# EAGLE board BT60 (EAGLE 9.6.2)
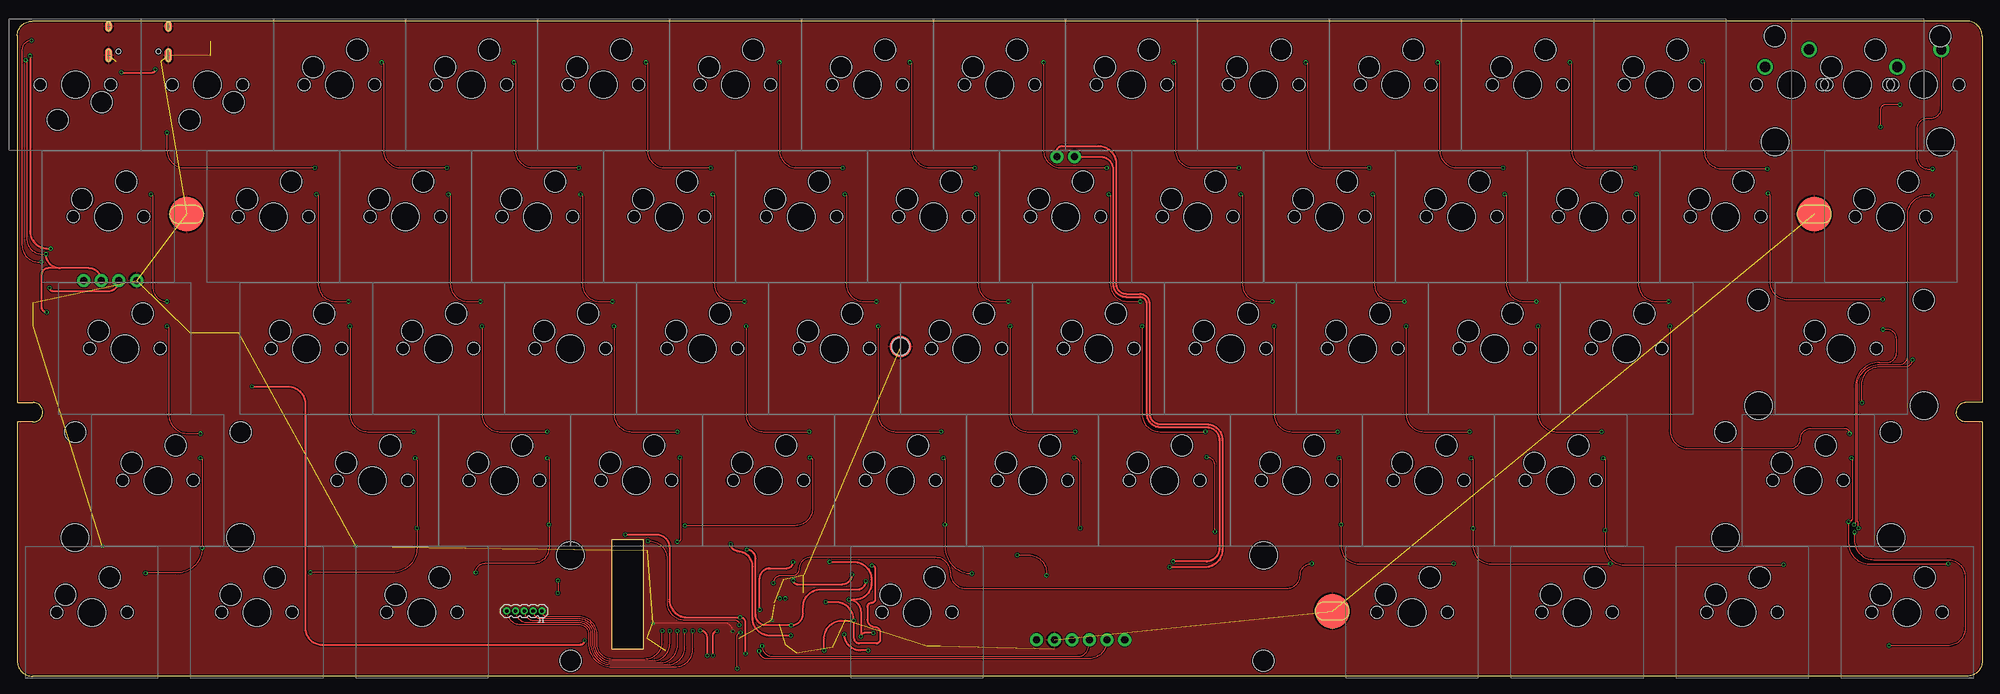
[diagram p2: board, top side]
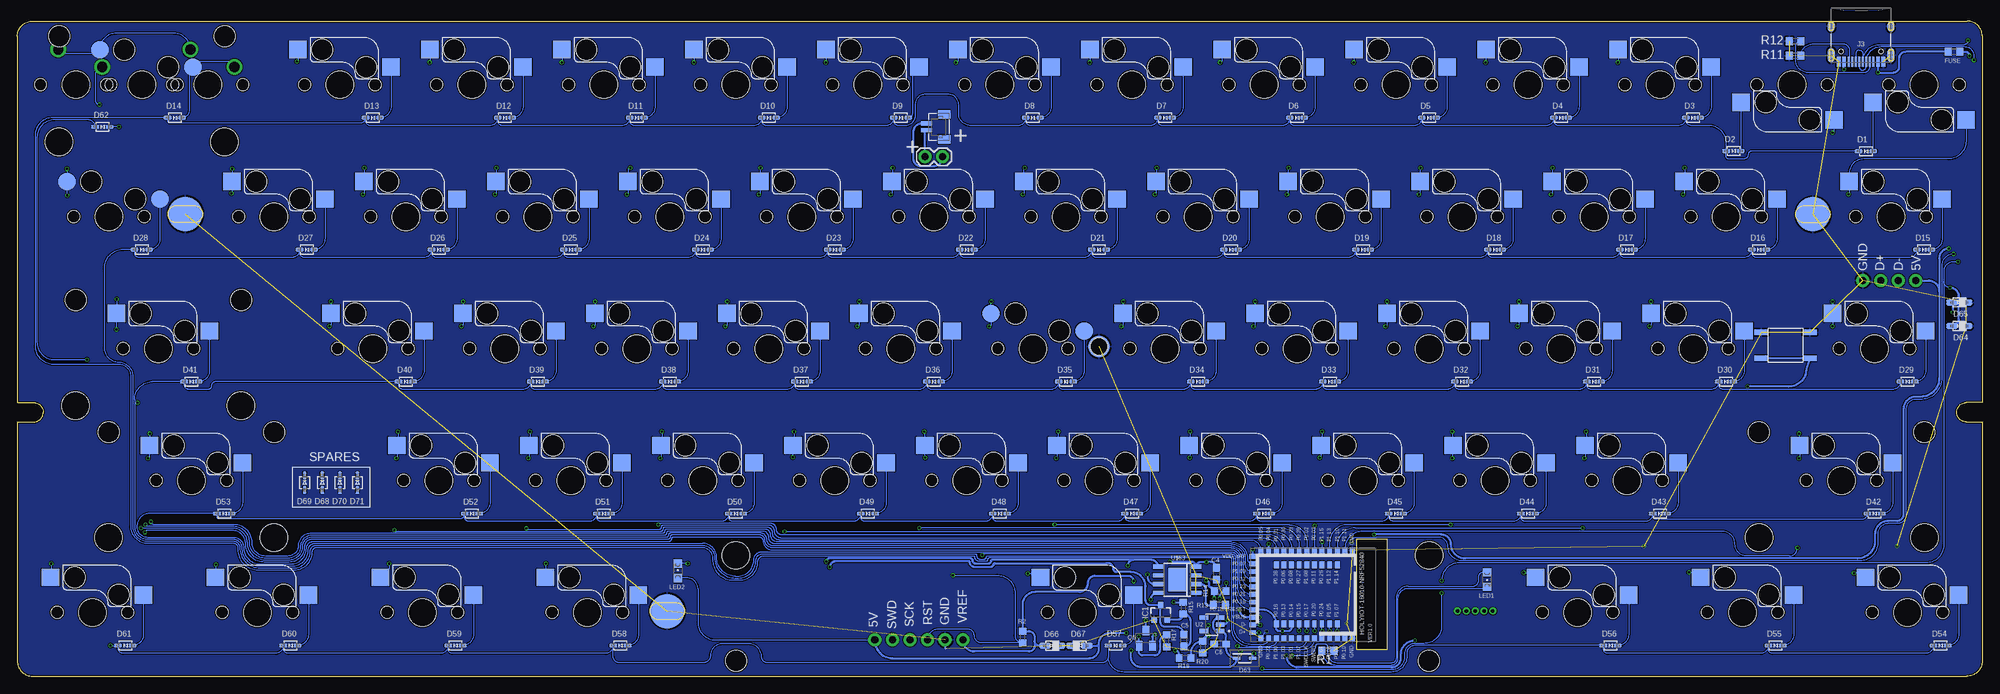
[diagram p3: board, bottom side, seen from below]

Size 283.53 x 94.59 mm. Coordinates in mm from the lower left corner, seen from the top.
Outline: 281.32,94.59 2.15,94.59 arc90 0.01,92.46 0,92.44 0,39.5 2.29,39.5 arc-90 3.68,38.1 arc-90 2.29,36.7 0,36.7 0,2.21 arc90 2.21,0 281.32,0 arc90 283.53,2.21 283.53,36.7 281.18,36.7 arc-90 279.78,38.1 arc-90 281.18,39.5 283.53,39.5 283.53,92.38 arc90 281.32,94.59
Copper layers (1*16): Top 0.035559375mm / dielectric 1.6mm / Bottom 0.035559375mm
Design rules "jlcpcb2layer": minimum track width 5mil, minimum drill 12mil, track to track 5mil, track to pad 5mil, pad to pad 5mil, via to via 5mil, smd to smd 5mil, copper to edge 8mil, drill to drill 6mil, minimum pad ring 5mil, minimum via ring 3mil, stop-mask expansion 2.5mil, vias tented up to drill 0mil, thermal gap 10mil

## Footprints (pad centres in the part's own frame; a part is rotated, then mirrored left to right if it is on the bottom)
C0603 = smd 1.1 x 1: 1 -0.85,0; 2 0.85,0
BM02B-SRSS-TB = smd 0.6 x 1.55: 1 0.5,0; 2 -0.5,0 | smd 1.2 x 1.8: M1 1.8,-2.525; M2 -1.8,-2.525
SOD-323 = smd 1.14 x 0.52: A 1.04,0; C -1.04,0
SOD2713X115N = smd 1.125 x 0.5: 1 -1.162,0; 2 1.162,0
SOD-323' = smd 1.676 x 0.813: A 1.04,0; C -1.04,0
R0603 = smd 1 x 1.1: 1 -0.85,0; 2 0.85,0
SOT23-3 = smd 0.8 x 0.9: 1 -0.95,-1; 2 0.95,-1; 3 0,1.1
PCBCOMPONENT_1 = smd 0.7 x 0.9: D+ 5.5,-7.8; D- 4.4,-7.8; P0.07 -4.4,-7.8; P0.12 -2.2,-7.8; P0.18 2.2,-7.8; P0.19 1.1,-7.8; P0.21 0,-7.8; P0.23 -1.1,-7.8; P1.09 -3.3,-7.8; VBUS 3.3,-7.8; VDD_NRF -5.5,-7.8 | smd 0.9 x 0.7: GND -6.35,6.6; GND1 6.35,-6.6; GND2 6.35,6.6; P0.02 -6.35,0; P0.03 -6.35,1.1; P0.04 -6.35,-5.5; P0.05 -6.35,-6.6; P0.09 6.35,4.4; P0.10 6.35,5.5; P0.22 6.35,-5.5; P0.28 -6.35,-1.1; P0.29 -6.35,-2.2; P0.30 -6.35,-3.3; P0.31 -6.35,-4.4; P1.00 6.35,-4.4; P1.01 6.35,-2.2; P1.02 6.35,-1.1; P1.03 6.35,-3.3; P1.04 6.35,2.2; P1.06 6.35,3.3; P1.10 -6.35,4.4; P1.11 -6.35,5.5; P1.13 -6.35,3.3; P1.15 -6.35,2.2; SWDCLK 6.35,0; SWDIO 6.35,1.1 | smd 1 x 0.7: P0.06 -4.25,-3.3; P0.08 -4.25,-2.2; P0.11 -4.25,1.1; P0.13 4.25,-3.3; P0.14 4.25,-2.2; P0.15 4.25,-1.1; P0.16 4.25,-4.4; P0.17 4.25,0; P0.25 -4.25,2.2; P0.26 -4.25,-4.4; P0.27 -4.25,-1.1; P1.05 4.25,3.3; P1.07 4.25,4.4; P1.08 -4.25,0; P1.12 -4.25,3.3; P1.14 -4.25,4.4 | smd 1 x 0.6: P0.20 4.25,1.1; P0.24 4.25,2.2
1X05_1.27MM = drill 0.508 pad 1: 1 0,0; 2 1.27,0; 3 2.54,0; 4 3.81,0; 5 5.08,0
1X04_NO_SILK = drill 1.016 pad 1.88: 1 0,0; 2 2.54,0; 3 5.08,0; 4 7.62,0
SPARKFUN-CONNECTORS_USB-C-16P = smd 0.3 x 1.45: A5 -1.25,0; A6 -0.25,0; A7 0.25,0; A8 1.25,0; B5 1.75,0; B6 0.75,0; B7 -0.75,0; B8 -1.75,0 | smd 0.6 x 1.45: GND -3.225,0; GND2 3.225,0 | smd 1 x 2.1: SHLD1 -4.32,-0.915; SHLD2 4.32,-0.915 | smd 1 x 2.1 bottom: SHLD3 -4.32,-0.915; SHLD4 4.32,-0.915 | smd 1 x 1.6: SHLD5 -4.32,-5.095; SHLD8 4.32,-5.095 | smd 1 x 1.6 bottom: SHLD6 -4.32,-5.095; SHLD7 4.32,-5.095 | smd 0.55 x 1.45: VBUS1 -2.45,0; VBUS2 2.45,0 | hole 0.65: -2.89,-1.445; 2.89,-1.445
1X02 = drill 1.016 pad 1.88: 1 0,0; 2 2.54,0
CHIPLED_0805 = smd 1.2 x 1.2: A 0,-1.05; C 0,1.05
1X06_NO_SILK = drill 1.016 pad 1.88: 1 0,0; 2 2.54,0; 3 5.08,0; 4 7.62,0; 5 10.16,0; 6 12.7,0
SOT23 = smd 1 x 1.4: 1 -0.95,-1.1; 2 0.95,-1.1; 3 0,1.1
SOT95P285X140-5N = smd 1.35 x 0.6: 1 -1.185,0.95; 2 -1.185,0; 3 -1.185,-0.95; 4 1.185,-0.95; 5 1.185,0.95
CHERRY = smd 2.55 x 2.5 bottom: 1 -7.37,2.54; 2 6.05,5.08 | hole 3.988: 0,0 | hole 1.753: 5.08,0; -5.08,0 | hole 3.048: -3.81,2.54; 2.54,5.08
CHERRY_CORNER_OFFED = smd 2.55 x 2.5 bottom: 1 -7.37,2.54; 2 6.05,5.08 | hole 3.988: 0,0 | hole 1.753: 5.08,0; -5.08,0 | hole 3.048: -3.81,2.54; 2.54,5.08
SMD-BUTTON = smd 2 x 0.75: A -3.5,1.875; B 3.5,1.875; C -3.5,-1.875; D 3.5,-1.875
SOIC8 = smd 0.6 x 1.5: 1 -1.905,-2.75; 2 -0.635,-2.75; 3 0.635,-2.75; 4 1.905,-2.75; 5 1.905,2.75; 6 0.635,2.75; 7 -0.635,2.75; 8 -1.905,2.75 | smd 3.4 x 2.5: P$1 0,0
2.5MM_ELONGATED = smd 5 x 5: P$1 0,0 | smd 5 x 5 bottom: P$2 0,0
2.5MM_HOLE = smd 3.1 x 3.1 bottom: P$1 0,0 | smd 3.1 x 3.1: P$2 0,0 | hole 2.5: 0,0
STAB-2U = hole 3.988: -11.938,-8.255; 11.938,-8.255 | hole 3.048: -11.938,6.985; 11.938,6.985
STAB-6.25U = hole 3.988: -50,-8.255; 50,-8.255 | hole 3.048: -50,6.985; 50,6.985
CHERRY-SOLDER = drill 1.499: P$1 -3.81,2.54; P$2 2.54,5.08 | hole 3.988: 0,0 | hole 1.702: -5.08,0; 5.08,0

## Placement (x,y rotation side)
C4  10u  [C0603]  110.49,14.8 270 bottom
C5  100n  [C0603]  115.2,5.16 90 bottom
C6  4.7u  [C0603]  109.96,4.64 180 bottom
CN2  BM02B-SRSS-TB  [BM02B-SRSS-TB]  152.32,79.31 90 bottom
D1  1N4148WS  [SOD-323]  16.78,75.79 0 bottom
D2  1N4148WS  [SOD-323]  35.88,75.82 0 bottom
D3  1N4148WS  [SOD-323]  41.72,80.63 0 bottom
D4  1N4148WS  [SOD-323]  60.77,80.63 0 bottom
D5  1N4148WS  [SOD-323]  79.82,80.63 0 bottom
D6  1N4148WS  [SOD-323]  98.87,80.63 0 bottom
D7  1N4148WS  [SOD-323]  117.92,80.63 0 bottom
D8  1N4148WS  [SOD-323]  136.97,80.63 0 bottom
D9  1N4148WS  [SOD-323]  156.02,80.63 0 bottom
D10  1N4148WS  [SOD-323]  175.07,80.63 0 bottom
D11  1N4148WS  [SOD-323]  194.12,80.63 0 bottom
D12  1N4148WS  [SOD-323]  213.17,80.63 0 bottom
D13  1N4148WS  [SOD-323]  232.22,80.63 0 bottom
D14  1N4148WS  [SOD-323]  260.79,80.63 0 bottom
D15  1N4148WS  [SOD-323]  8.38,61.58 0 bottom
D16  1N4148WS  [SOD-323]  32.19,61.58 0 bottom
D17  1N4148WS  [SOD-323]  51.24,61.58 0 bottom
D18  1N4148WS  [SOD-323]  70.29,61.58 0 bottom
D19  1N4148WS  [SOD-323]  89.34,61.58 0 bottom
D20  1N4148WS  [SOD-323]  108.39,61.58 0 bottom
D21  1N4148WS  [SOD-323]  127.44,61.58 0 bottom
D22  1N4148WS  [SOD-323]  146.49,61.58 0 bottom
D23  1N4148WS  [SOD-323]  165.54,61.58 0 bottom
D24  1N4148WS  [SOD-323]  184.59,61.58 0 bottom
D25  1N4148WS  [SOD-323]  203.64,61.58 0 bottom
D26  1N4148WS  [SOD-323]  222.69,61.58 0 bottom
D27  1N4148WS  [SOD-323]  241.74,61.58 0 bottom
D28  1N4148WS  [SOD-323]  265.56,61.58 0 bottom
D29  1N4148WS  [SOD-323]  10.76,42.53 0 bottom
D30  1N4148WS  [SOD-323]  36.96,42.53 0 bottom
D31  1N4148WS  [SOD-323]  56.01,42.53 0 bottom
D32  1N4148WS  [SOD-323]  75.06,42.53 0 bottom
D33  1N4148WS  [SOD-323]  94.11,42.53 0 bottom
D34  1N4148WS  [SOD-323]  113.16,42.53 0 bottom
D35  1N4148WS  [SOD-323]  132.21,42.53 0 bottom
D36  1N4148WS  [SOD-323]  151.26,42.53 0 bottom
D37  1N4148WS  [SOD-323]  170.31,42.53 0 bottom
D38  1N4148WS  [SOD-323]  189.36,42.53 0 bottom
D39  1N4148WS  [SOD-323]  208.41,42.53 0 bottom
D40  1N4148WS  [SOD-323]  227.46,42.53 0 bottom
D41  1N4148WS  [SOD-323]  258.41,42.53 0 bottom
D42  1N4148WS  [SOD-323]  15.53,23.48 0 bottom
D43  1N4148WS  [SOD-323]  46.48,23.48 0 bottom
D44  1N4148WS  [SOD-323]  65.53,23.48 0 bottom
D45  1N4148WS  [SOD-323]  84.58,23.48 0 bottom
D46  1N4148WS  [SOD-323]  103.63,23.48 0 bottom
D47  1N4148WS  [SOD-323]  122.68,23.48 0 bottom
D48  1N4148WS  [SOD-323]  141.73,23.48 0 bottom
D49  1N4148WS  [SOD-323]  160.78,23.48 0 bottom
D50  1N4148WS  [SOD-323]  179.83,23.48 0 bottom
D51  1N4148WS  [SOD-323]  198.88,23.48 0 bottom
D52  1N4148WS  [SOD-323]  217.93,23.48 0 bottom
D53  1N4148WS  [SOD-323]  253.65,23.48 0 bottom
D54  1N4148WS  [SOD-323]  6,4.43 0 bottom
D55  1N4148WS  [SOD-323]  29.81,4.43 0 bottom
D56  1N4148WS  [SOD-323]  53.63,4.43 0 bottom
D57  1N4148WS  [SOD-323]  125.06,4.43 0 bottom
D58  1N4148WS  [SOD-323]  196.5,4.43 0 bottom
D59  1N4148WS  [SOD-323]  220.31,4.43 0 bottom
D60  1N4148WS  [SOD-323]  244.13,4.43 0 bottom
D61  1N4148WS  [SOD-323]  267.94,4.43 0 bottom
D62  1N4148WS  [SOD-323]  271.25,79.31 0 bottom
D63  SD103AWS-E3-08  [SOD2713X115N]  106.42,2.59 0 bottom
D64  ESDSOD323  [SOD-323']  3.3,50.56 180 bottom
D65  ESDSOD323  [SOD-323']  3.3,53.96 180 bottom
D66  ESDSOD323  [SOD-323']  134.19,4.41 180 bottom
D67  ESDSOD323  [SOD-323']  130.25,4.41 0 bottom
D68  1N4148WS  [SOD-323]  239.52,27.93 270 bottom
D69  1N4148WS  [SOD-323]  242.06,27.93 270 bottom
D70  1N4148WS  [SOD-323]  236.98,27.93 270 bottom
D71  1N4148WS  [SOD-323]  234.44,27.93 270 bottom
FUSE  500m  [R0603]  4.06,90.16 180 bottom
IC1  XB3303ASOT23  [SOT23-3]  118.54,9.16 0 bottom
IC3  HOLYIOT_18010  [PCBCOMPONENT_1]  97.46,11.8 270 bottom
J1  [1X05_1.27MM]  75.7,9.42 180 top
J2  [1X04_NO_SILK]  9.58,57.14 0 top
J3  [SPARKFUN-CONNECTORS_USB-C-16P]  17.48,88.73 180 bottom
J4  [1X02]  152.53,74.99 0 bottom
LED1  [CHIPLED_0805]  71.44,13.96 180 bottom
LED2  [CHIPLED_0805]  188.21,15.23 0 bottom
PROG1  [1X06_NO_SILK]  147.1,5.25 0 top
Q5  PMOSFET  [SOT23]  120.69,5.51 0 bottom
R1  1k  [R0603]  94.41,3.67 180 bottom
R2  10k  [R0603]  138.46,5.65 270 bottom
R11  5.1k  [R0603]  26.99,89.58 0 bottom
R12  5.1k  [R0603]  26.99,91.67 0 bottom
R13  2k  [R0603]  110.05,10.3 180 bottom
R14  1k  [R0603]  109.95,12.27 180 bottom
R15  100  [R0603]  115.28,9.84 90 bottom
R17  100k  [R0603]  117.67,5.11 90 bottom
R19  2k  [R0603]  115.02,2.63 0 bottom
R20  2k  [R0603]  112.46,4.2 270 bottom
U2  AP2112K-3.3TRG1  [SOT95P285X140-5N]  111.12,7.49 180 bottom
U$1  [CHERRY]  8.38,85.39 180 top
U$2  [CHERRY]  27.43,85.39 180 top
U$3  [CHERRY]  46.48,85.39 0 top
U$4  [CHERRY]  65.53,85.39 0 top
U$5  [CHERRY]  84.58,85.39 0 top
U$6  [CHERRY]  103.63,85.39 0 top
U$7  [CHERRY]  122.68,85.39 0 top
U$8  [CHERRY]  141.73,85.39 0 top
U$9  [CHERRY]  160.78,85.39 0 top
U$10  [CHERRY]  179.83,85.39 0 top
U$11  [CHERRY]  198.88,85.39 0 top
U$12  [CHERRY]  217.93,85.39 0 top
U$13  [CHERRY]  236.98,85.39 0 top
U$14  [CHERRY_CORNER_OFFED]  265.56,85.39 0 top
U$15  [CHERRY]  13.14,66.34 0 top
U$16  [CHERRY]  36.96,66.34 0 top
U$17  [CHERRY]  56.01,66.34 0 top
U$18  [CHERRY]  75.06,66.34 0 top
U$19  [CHERRY]  94.11,66.34 0 top
U$20  [CHERRY]  113.16,66.34 0 top
U$21  [CHERRY]  132.21,66.34 0 top
U$22  [CHERRY]  151.26,66.34 0 top
U$23  [CHERRY]  170.33,66.34 0 top
U$24  [CHERRY]  189.36,66.34 0 top
U$25  [CHERRY]  208.41,66.34 0 top
U$26  [CHERRY]  227.46,66.34 0 top
U$27  [CHERRY]  246.51,66.34 0 top
U$28  [CHERRY_CORNER_OFFED]  270.32,66.34 0 top
U$29  [CHERRY]  15.53,47.29 0 top
U$30  [CHERRY]  41.72,47.29 0 top
U$31  [CHERRY]  60.77,47.29 0 top
U$32  [CHERRY]  79.82,47.29 0 top
U$33  [CHERRY]  98.87,47.29 0 top
U$34  [CHERRY]  117.92,47.29 0 top
U$35  [CHERRY_CORNER_OFFED]  136.97,47.29 0 top
U$36  [CHERRY]  156.02,47.29 0 top
U$37  [CHERRY]  175.07,47.29 0 top
U$38  [CHERRY]  194.12,47.29 0 top
U$39  [CHERRY]  213.17,47.29 0 top
U$40  [CHERRY]  232.22,47.29 0 top
U$41  [CHERRY]  263.18,47.29 0 top
U$42  [CHERRY]  20.29,28.24 0 top
U$43  [CHERRY]  51.24,28.24 0 top
U$44  [CHERRY]  70.29,28.24 0 top
U$45  [CHERRY]  89.34,28.24 0 top
U$46  [CHERRY]  108.39,28.24 0 top
U$47  [CHERRY]  127.44,28.24 0 top
U$48  [CHERRY]  146.49,28.24 0 top
U$49  [CHERRY]  165.54,28.24 0 top
U$50  [CHERRY]  184.59,28.24 0 top
U$51  [CHERRY]  203.64,28.24 0 top
U$52  [CHERRY]  222.69,28.24 0 top
U$53  [CHERRY]  258.41,28.24 0 top
U$54  [CHERRY]  10.76,9.19 0 top
U$55  [CHERRY]  34.58,9.19 0 top
U$56  [CHERRY]  58.39,9.19 0 top
U$57  [CHERRY]  129.83,9.19 0 top
U$58  [CHERRY]  201.26,9.19 0 top
U$59  [CHERRY]  225.08,9.19 0 top
U$60  [CHERRY]  248.89,9.19 0 top
U$61  [CHERRY]  272.7,9.19 0 top
U$62  SMD-BUTTON  [SMD-BUTTON]  28.37,47.77 0 bottom
U$63  TP4056SOI8  [SOIC8]  116.17,13.93 90 bottom
U$64  2.5MM_ELONGATED  [2.5MM_ELONGATED]  189.74,9.4 0 top
U$65  2.5MM_ELONGATED  [2.5MM_ELONGATED]  259.28,66.71 0 top
U$66  2.5MM_HOLE  [2.5MM_HOLE]  127.43,47.6 0 top
U$67  2.5MM_ELONGATED  [2.5MM_ELONGATED]  24.43,66.69 0 top
U$68  STAB-2U  [STAB-2U]  20.29,28.24 0 top
U$69  STAB-2U  [STAB-2U]  263.18,47.29 0 top
U$70  STAB-2U  [STAB-2U]  265.56,85.39 0 top
U$71  STAB-2U  [STAB-2U]  258.41,28.24 0 top
U$72  STAB-6U  [STAB-6.25U]  129.83,9.19 180 top
U$73  CHERRY-SOLDER  [CHERRY-SOLDER]  256.03,85.39 0 top
U$74  CHERRY-SOLDER  [CHERRY-SOLDER]  275.08,85.39 0 top

## Tracks (layer width: path | path; a pad name or v marks a point on that pad's centre or on a via)
BLED  (via drill 0.35)
  Top 0.305: v99.57,2.98 99.57,5.58 arc90 v98.55,6.59
  Bottom 0.152: v99.57,2.98 97.54,2.98 arc-90 96.24,4.28 arc90 95.91,4.61 94.79,4.61 arc90 94.39,4.2 94.39,3.29 arc-90 92.99,1.89 85.29,1.89 arc-90 84.56,2.63 84.56,11.24 arc90 82.8,12.99 73.53,12.99 arc-90 72.64,13.88 72.64,14.34 arc90 71.93,15.05 71.48,15.05 arc90 LED1.A
  Bottom 0.305: v98.55,6.59 IC3.P0.15 arc-90 IC3.P0.15
BVOLT  (via drill 0.35)
  Top 0.305: v111.61,5.85 108.64,5.85 arc-90 106.1,8.39 106.1,15.84 arc90 103.91,18.02 103.91,18.11 arc-90 v102.94,19.08
  Bottom 0.305: R19.2 114.17,3.35 arc90 R20.1 arc90 111.67,5.85 v111.61,5.85 | v102.94,19.08 arc-90 102.96,19.06 IC3.P0.04
COL1  (via drill 0.35)
  Top 0.152: v19.3,69.58 arc-90 19.56,69.33 19.56,56.12 arc90 v21.59,54.09 | v21.59,50.53 arc-90 21.84,50.28 21.84,37.83 arc90 24.64,35.04 v26.42,35.04 | v26.42,31.48 arc-90 26.67,31.23 v26.67,18.53 arc-90 23.04,14.9 v18.52,14.9
  Bottom 0.152: U$1.2 2.33,77.23 arc90 4.87,74.69 17.09,74.69 arc-90 19.19,72.59 U$15.2 19.19,69.69 arc90 v19.3,69.58 | v21.59,54.09 21.59,52.39 arc-90 U$29.2 21.58,50.55 arc90 v21.59,50.53 | v26.42,35.04 26.42,33.4 arc-90 U$42.2 26.34,31.56 arc90 v26.42,31.48 | v26.67,18.53 arc90 27.84,17.36 33.98,17.36 arc90 35.66,19.04 arc-90 37.54,20.92 89.42,20.92 arc-90 91.96,18.38 IC3.P1.11 | U$54.2 arc-90 17.44,14.9 v18.52,14.9
COL2  (via drill 0.35)
  Top 0.152: v21.59,78.47 21.59,75.93 arc90 24.13,73.39 v42.93,73.39 | v43.18,69.58 arc-90 43.43,69.33 43.43,56.63 arc90 45.97,54.09 v47.75,54.09 | v48.01,50.53 48.01,37.83 arc90 50.55,35.29 v57.15,35.29 | v57.4,31.48 arc-90 57.66,31.23 v57.66,21.4 57.66,18.53 arc-90 54.13,15 v42.29,15
  Bottom 0.152: U$2.2 21.38,78.68 arc90 v21.59,78.47 | v42.93,73.39 42.93,71.6 arc90 43.05,71.47 U$16.2 43.01,69.76 arc90 v43.18,69.58 | v47.75,54.09 arc-90 47.77,54.07 U$30.2 47.77,50.77 arc90 v48.01,50.53 | v57.15,35.29 57.15,33.47 arc90 U$43.2 57.29,31.59 arc90 v57.4,31.48 | v42.29,15 41.35,15 arc-90 U$55.2 | v57.66,21.4 90.52,21.4 arc-90 93.06,18.86 IC3.P1.10 arc90 IC3.P1.10
COL3  (via drill 0.35)
  Top 0.152: v52.58,88.63 arc-90 52.83,88.38 52.83,75.93 arc90 55.37,73.39 v61.98,73.39 | v62.23,69.58 arc-90 62.48,69.33 62.48,56.63 arc90 65.02,54.09 v66.8,54.09 | v67.06,50.53 67.06,37.83 arc90 69.6,35.29 v76.45,35.29 | v76.45,31.48 arc-90 76.71,31.23 v76.71,21.87 76.71,18.53 arc-90 74.5,16.32 67.51,16.32 arc90 v66.14,14.95
  Bottom 0.152: U$3.2 52.53,88.68 arc90 v52.58,88.63 | v61.98,73.39 arc-90 62.06,73.31 U$17.2 62.06,69.76 arc90 v62.23,69.58 | v66.8,54.09 arc-90 66.82,54.07 U$31.2 66.82,50.77 arc90 v67.06,50.53 | v76.45,35.29 76.45,33.43 arc-90 U$44.2 arc-90 76.45,33.22 v76.45,31.48 | v66.14,14.95 65.11,14.95 arc-90 U$56.2 | v76.71,21.87 91.62,21.87 arc-90 94.16,19.33 IC3.P1.13 arc90 IC3.P1.13
COL4  (via drill 0.35)
  Top 0.152: v71.63,88.63 arc-90 71.88,88.38 71.88,75.93 arc90 74.42,73.39 v81.03,73.39 | v81.28,69.58 arc-90 81.53,69.33 81.53,56.63 arc90 84.07,54.09 v85.85,54.09 | v86.11,50.53 86.11,37.83 arc90 88.65,35.29 v95.25,35.29 | v95.58,31.56 arc-90 95.71,31.43 95.71,19.85 arc-90 v95.25,19.39
  Bottom 0.152: U$4.2 71.58,88.68 arc90 v71.63,88.63 | v81.03,73.39 arc-90 81.11,73.31 U$18.2 81.11,69.76 arc90 v81.28,69.58 | v85.85,54.09 arc-90 85.87,54.07 U$32.2 85.87,50.77 arc90 v86.11,50.53 | v95.25,35.29 95.25,33.47 arc90 U$45.2 95.4,31.75 arc90 v95.58,31.56 | v95.25,19.39 arc-90 95.26,19.38 IC3.P1.15
COL5  (via drill 0.35)
  Top 0.152: v90.68,88.63 arc-90 90.93,88.38 90.93,75.93 arc90 93.47,73.39 v100.08,73.39 | v100.33,69.58 arc-90 100.58,69.33 100.58,56.63 arc90 103.12,54.09 v104.9,54.09 | v105.16,50.53 105.16,37.83 arc90 107.7,35.29 v114.3,35.29 | v114.35,31.56 arc-90 114.76,31.15 114.76,24.27 arc-90 112.22,21.73 v96.34,21.73
  Bottom 0.152: U$5.2 90.63,88.68 arc90 v90.68,88.63 | v100.08,73.39 arc-90 100.16,73.31 U$19.2 100.16,69.76 arc90 v100.33,69.58 | v104.9,54.09 arc-90 104.92,54.07 U$33.2 104.92,50.77 arc90 v105.16,50.53 | v114.3,35.29 114.3,33.47 arc90 U$46.2 arc90 114.35,33.23 v114.35,31.56 | v96.34,21.73 arc-90 96.36,21.71 IC3.P0.03
COL6  (via drill 0.35)
  Top 0.152: v109.98,88.63 109.98,75.93 arc90 112.52,73.39 v119.13,73.39 | v119.38,69.58 arc-90 119.63,69.33 119.63,56.63 arc90 122.17,54.09 v123.95,54.09 | v124.21,50.53 124.21,37.83 arc90 126.75,35.29 v133.35,35.29 | v133.6,31.48 arc-90 133.86,31.23 v133.86,21.87 133.86,18.68 arc90 v137.72,14.82
  Bottom 0.152: U$6.2 109.68,88.93 arc90 v109.98,88.63 | v119.13,73.39 119.13,71.6 arc90 119.25,71.47 U$20.2 119.21,69.76 arc90 v119.38,69.58 | v123.95,54.09 arc-90 123.97,54.07 U$34.2 123.97,50.77 arc90 v124.21,50.53 | v133.35,35.29 133.35,33.47 arc90 U$47.2 133.49,31.59 arc90 v133.6,31.48 | v137.72,14.82 136.42,14.82 arc-90 U$57.2 | v133.86,21.87 100,21.87 arc90 97.46,19.33 IC3.P0.02 arc90 IC3.P0.02
COL7  (via drill 0.35)
  Top 0.152: v128.78,88.63 arc-90 129.03,88.38 129.03,76.19 arc90 131.83,73.39 v138.18,73.39 | v138.43,69.58 arc-90 138.68,69.33 138.68,56.63 arc90 141.22,54.09 v143,54.09 | v143.26,50.53 143.26,37.83 arc90 145.8,35.29 v152.65,35.29 | v153.37,21.37 153.37,30.7 arc90 v152.53,31.53
  Bottom 0.152: U$7.2 128.73,88.68 arc90 v128.78,88.63 | v138.18,73.39 arc-90 138.3,73.27 138.3,71.47 U$21.2 138.26,69.76 arc90 v138.43,69.58 | v143.26,50.53 arc-90 143.02,50.77 U$35.2 143.02,54.07 arc90 v143,54.09 | v152.65,35.29 152.65,33.43 | 152.65,33.43 arc-90 U$48.2 | v153.37,21.37 arc90 153.34,21.4 101.1,21.4 arc90 98.56,18.86 IC3.P0.28 arc90 IC3.P0.28 | v152.53,31.53 152.53,33.31 arc-90 152.65,33.43
COL8  (via drill 0.35)
  Top 0.152: v148.08,88.63 148.08,75.93 arc90 150.62,73.39 v157.23,73.39 | v157.48,69.58 arc-90 157.73,69.33 157.73,56.63 arc90 160.27,54.09 v162.05,54.09 | v162.31,50.53 162.31,37.83 arc90 164.85,35.29 v171.45,35.29 | v172.82,20.89 172.82,30.39 arc90 v171.6,31.61
  Bottom 0.152: U$8.2 147.78,88.93 arc90 v148.08,88.63 | v157.23,73.39 157.23,71.6 arc90 157.35,71.47 U$22.2 157.31,69.76 arc90 v157.48,69.58 | v162.05,54.09 arc-90 162.07,54.07 U$36.2 162.07,50.77 arc90 v162.31,50.53 | v171.45,35.29 171.45,33.47 arc90 U$49.2 arc-90 U$49.2 v171.6,31.61 | v172.82,20.89 102.2,20.89 arc90 99.66,18.35 IC3.P0.29
COL9  (via drill 0.35)
  Top 0.152: v166.88,88.63 arc-90 167.13,88.38 167.13,75.93 arc90 169.67,73.39 v176.28,73.39 | v176.53,69.58 arc-90 176.78,69.33 176.78,56.63 arc90 179.32,54.09 v181.1,54.09 | v181.36,50.53 181.36,37.83 arc90 183.9,35.29 v190.5,35.29 | v190.75,31.48 arc-90 191.01,31.23 v191.01,21.87 191.01,18.78 arc90 193.55,16.24 v207.26,16.24
  Bottom 0.152: U$50.2 190.5,33.47 | U$9.2 166.83,88.68 arc90 v166.88,88.63 | v176.28,73.39 arc-90 176.38,73.29 U$23.2 176.38,69.73 arc90 v176.53,69.58 | v181.1,54.09 arc-90 181.12,54.07 U$37.2 181.12,50.77 arc90 v181.36,50.53 | v190.5,35.29 190.5,33.47 | 190.5,33.47 arc90 U$50.2 | U$50.2 190.64,31.59 arc90 v190.75,31.48 | v207.26,16.24 207.26,14.32 arc90 U$58.2 | v191.01,21.87 arc90 190.82,22.06 174.83,22.06 arc90 173.99,21.22 arc-90 173.18,20.41 103.02,20.41 arc90 IC3.P0.30
COL10  (via drill 0.35)
  Top 0.152: v185.93,88.63 arc-90 186.18,88.38 186.18,75.93 arc90 188.72,73.39 v195.07,73.39 | v195.58,69.58 arc-90 195.83,69.33 195.83,56.63 arc90 198.37,54.09 v200.15,54.09 | v200.41,50.53 200.41,37.83 arc90 202.95,35.29 v209.55,35.29 | v209.8,31.48 arc-90 210.06,31.23 v210.06,21.35 210.06,18.78 arc90 212.6,16.24 v229.87,16.24
  Bottom 0.152: U$10.2 185.88,88.68 arc90 v185.93,88.63 | v195.07,73.39 arc-90 195.41,73.06 U$24.2 195.41,69.76 arc90 v195.58,69.58 | v200.15,54.09 arc-90 200.17,54.07 U$38.2 200.17,50.77 arc90 v200.41,50.53 | v209.55,35.29 209.55,33.47 arc90 U$51.2 209.69,31.59 arc90 v209.8,31.48 | v229.87,16.24 229.87,15.53 arc90 U$59.2 | v210.06,21.35 arc90 209.86,21.15 190.96,21.15 arc-90 190.65,21.45 arc90 190.32,21.78 175.08,21.78 arc90 174.27,20.97 arc-90 173.23,19.93 103.39,19.93 arc90 101.86,18.39 IC3.P0.31
COL11  (via drill 0.35)
  Top 0.152: v204.98,88.63 arc-90 205.23,88.38 205.23,75.93 arc90 207.77,73.39 v214.38,73.39 | v214.63,69.58 arc-90 214.88,69.33 214.88,56.63 arc90 217.42,54.09 v219.2,54.09 | v219.46,50.53 219.46,37.83 arc90 222,35.29 v228.6,35.29 | v228.85,31.48 arc-90 229.13,31.2 v229.13,21.09 229.13,18.76 arc90 231.8,16.09 v254.86,16.09
  Bottom 0.152: U$52.2 228.6,33.47 | U$11.2 204.93,88.68 arc90 v204.98,88.63 | v214.38,73.39 arc-90 214.46,73.31 U$25.2 214.46,69.76 arc90 v214.63,69.58 | v219.2,54.09 arc-90 219.22,54.07 U$39.2 219.22,50.77 arc90 v219.46,50.53 | v228.6,35.29 228.6,33.47 | 228.6,33.47 arc90 U$52.2 | U$52.2 228.75,31.59 arc90 v228.85,31.48 | v254.86,16.09 arc-90 254.94,16.02 U$60.2 | v229.13,21.09 228.91,20.87 190.75,20.87 arc-90 190.37,21.25 arc90 190.12,21.5 175.36,21.5 arc90 174.55,20.69 arc-90 173.51,19.65 105.56,19.65 arc90 IC3.P0.05
COL12  (via drill 0.35)
  Top 0.152: v224.03,88.63 arc-90 224.28,88.38 224.28,75.93 arc90 226.82,73.39 v233.43,73.39 | v233.68,69.58 arc-90 233.93,69.33 233.93,56.63 arc90 236.47,54.09 v238.25,54.09 | v238.51,50.53 238.51,35.55 arc90 241.2,32.86 255.88,32.86 arc90 257.3,34.28 arc-90 258.83,35.8 263.65,35.8 arc-90 v264.41,35.04 | v278.64,16.24 267.21,16.24 arc-90 264.24,19.22 v264.24,22.29 arc90 264.82,22.87 264.82,31.33 arc90 v264.67,31.48
  Bottom 0.152: U$53.2 264.41,33.37 | U$12.2 223.98,88.68 arc90 v224.03,88.63 | v233.43,73.39 arc-90 233.51,73.31 U$26.2 233.51,69.76 arc90 v233.68,69.58 | v238.25,54.09 arc-90 238.27,54.07 U$40.2 238.27,50.77 arc90 v238.51,50.53 | v264.41,35.04 264.41,33.37 | 264.41,33.37 arc90 U$53.2 | U$53.2 264.46,31.69 arc90 v264.67,31.48 | v278.64,16.24 278.64,14.39 arc90 U$61.2 | v264.24,22.29 arc-90 263.83,21.88 252.2,21.88 arc90 249.66,19.34 249.66,19.29 arc-90 247.7,17.34 244.5,17.34 arc-90 243,18.83 arc90 241.25,20.59 190.47,20.59 arc-90 190.12,20.94 arc90 189.84,21.22 175.64,21.22 arc90 174.83,20.41 arc-90 173.79,19.37 108.33,19.37 arc90 106.05,17.08 106.05,16.98 arc-90 IC3.P0.07
COL13  (via drill 0.35)
  Top 0.152: v243.21,88.76 arc-90 243.43,88.53 243.43,75.81 arc90 245.97,73.27 v252.53,73.27 | v252.6,69.69 arc-90 252.88,69.41 252.88,56.93 arc90 255.42,54.39 v269.19,54.39 | v269.22,50.05 269.8,50.05 arc-90 271.17,48.68 271.17,46.72 arc-90 269.72,45.28 268.68,45.28 arc90 265.2,41.8 265.2,22.08 arc-90 v265.01,21.89
  Bottom 0.152: U$41.2 269.23,52.45 | v269.22,50.05 269.22,52.44 arc-90 269.23,52.45 | U$13.2 243.03,88.93 arc90 v243.21,88.76 | v252.53,73.27 arc-90 252.56,73.24 U$27.2 252.56,69.73 arc90 v252.6,69.69 | v269.19,54.39 269.19,52.49 arc90 269.23,52.45 | v265.01,21.89 arc-90 264.73,21.6 252.27,21.6 arc90 250.01,19.34 arc-90 247.7,17.03 244.37,17.03 arc-90 242.7,18.71 arc90 241.1,20.31 190.19,20.31 arc-90 189.87,20.64 arc90 189.56,20.94 176,20.94 arc90 175.08,20.03 175.08,20 arc-90 174.17,19.09 108.33,19.09 arc90 106.35,17.11 106.35,16.19 arc-90 IC3.P1.09
COL14  (via drill 0.35)
  Top 0.152: v276.33,69.41 275.51,69.41 arc90 272.77,66.66 272.77,46.16 arc-90 271.6,45 268.68,45 arc90 265.48,41.8 265.48,22.36 arc90 265.56,22.29 arc-90 265.68,22.16 v265.68,21.4 | v276.35,73.22 275.82,73.22 arc-90 274.09,74.94 274.09,78.98 arc-90 275.59,80.48 276.02,80.48 arc90 277.62,82.08 U$74.P$2
  Bottom 0.152: v276.33,69.41 276.33,71.16 | 276.33,71.16 276.33,71.38 arc-90 U$28.2 | v276.35,73.22 276.35,71.18 arc-90 276.33,71.16 | v265.68,21.4 arc90 265.61,21.32 252.37,21.32 arc90 250.32,19.27 arc-90 247.8,16.75 244.35,16.75 arc-90 242.42,18.68 arc90 241.07,20.03 189.92,20.03 arc-90 189.59,20.36 arc90 189.28,20.66 176.3,20.66 arc90 175.36,19.72 arc-90 174.45,18.81 108.33,18.81 arc90 106.66,17.13 106.66,15.39 arc-90 IC3.P0.12 | U$73.P$2 arc-90 260.92,92.82 269.26,92.82 arc-90 U$14.2 arc90 272.18,89.9 277.05,89.9 arc90 U$74.P$2
D+  (via drill 0.35)
  Top 0.152: v103.89,1.13 103.89,5.8 arc-90 v104.37,6.29 | v78,13.83 v78,12 | v2.02,91.76 arc90 0.67,90.41 0.67,62.22 arc90 3.09,59.8 v3.48,59.8
  Top 0.305: J2.3 arc-90 13.08,55.56 5.18,55.56 arc-90 v4.65,56.1
  Bottom 0.152: J3.A6 17.23,88.76 | 17.23,88.76 arc90 14.79,91.2 2.58,91.2 arc-90 v2.02,91.76 | v3.48,59.8 4.22,59.8 arc-90 5.56,58.46 5.56,57.01 | v78,13.83 arc90 75.46,16.37 8.1,16.37 arc-90 5.56,18.91 5.56,57.01 | v103.89,1.13 arc-90 103.66,0.9 85.24,0.9 arc-90 83.36,2.78 83.36,3.21 arc90 81.86,4.71 80.54,4.71 arc-90 78,7.25 v78,12 | v4.65,56.1 arc90 5.56,57.01 | 17.23,88.76 17.23,89.88 arc-90 17.74,90.4 arc-90 18.23,89.92 J3.B6 | IC3.D+ v104.38,6.3 arc90 v104.37,6.29
  Bottom 0.305: D64.A arc-90 3.35,51.55 3.35,54.8 arc-90 v4.65,56.1
D-  (via drill 0.35)
  Top 0.152: v90.96,19.52 91.21,19.52 arc-90 93.75,16.98 93.75,10.68 arc90 96.29,8.14 103.45,8.14 arc-90 v104.19,7.4 | v1.21,88.94 1.36,88.79 1.36,63.18 arc90 3.59,60.95 v4.13,60.95
  Top 0.305: J2.2 arc90 10.36,58.89 6.18,58.89 | v4.24,52.57 arc-90 3.5,53.3 3.5,57.98 arc-90 4.42,58.89 6.18,58.89 | 6.18,58.89 arc-90 v4.13,60.95
  Bottom 0.152: J3.A7 17.73,87.94 arc-90 17.27,87.49 arc-90 16.73,88.04 J3.B7 arc90 14.53,90.92 2.56,90.92 arc90 1.21,89.56 v1.21,88.94 | v90.96,19.52 arc90 90.53,19.95 87.53,19.95 arc-90 87.48,20 arc90 87.4,20.08 78.49,20.08 arc90 77.06,18.66 arc-90 75.06,16.65 17.63,16.65 arc-90 15.09,19.19 15.09,20.54 arc90 13.59,22.03 12.27,22.03 arc-90 11,23.3 11,38.54 arc90 9.6,39.94 8.91,39.94 arc-90 5.84,43.02 5.84,59.23 arc90 v4.13,60.95 | IC3.D- arc90 IC3.D- v104.19,7.4
  Bottom 0.305: D65.A arc90 4.24,53.86 v4.24,52.57
G_BAT  (via drill 0.35)
  Top 0.305: J4.2 149.99,75.76 arc-90 150.77,76.54 156.01,76.54 arc-90 158.55,74 158.55,56.65 arc90 160,55.21 161.95,55.21 arc-90 163.37,53.78 163.37,37.99 arc90 164.97,36.39 171.6,36.39 arc-90 173.89,34.1 173.89,18.28 arc-90 171.35,15.74 v166.27,15.74
  Bottom 0.305: v166.27,15.74 arc90 165.38,16.62 146.3,16.62 arc90 146.1,16.42 arc-90 145.49,15.81 143,15.81 arc-90 142.65,16.17 arc90 142.49,16.32 126.37,16.32 126.19,16.32 arc90 125.35,15.48 arc-90 124.9,15.04 122.85,15.04 arc90 120.73,12.92 120.73,10.99 arc-90 120,10.26 IC1.3 118.54,7.73 arc-90 117.96,7.15 116.33,7.15 arc90 C5.2 | CN2.1 152.99,79.81 arc-90 154.25,78.55 154.25,74.77 arc-90 153.14,73.65 151.34,73.65 arc-90 J4.2
GND  (via drill 0.3, 0.35)  (35 unrouted)
  Top 0.152: v103.25,6.46 arc90 102.06,7.66 v91.69,7.66
  Bottom 0.152: IC3.GND1 104.06,5.65 v103.25,6.46 arc90 v103.25,6.46
  Bottom 0.305: R13.1 109.2,10.63 | U2.2 109.49,7.49 arc-90 v108.86,8.12 | PROG1.2 149.64,4.03 arc-90 149.58,3.98
  other vias: 48.82,18.76 12.27,18.78
  pour Top: -1.27,94.98 285.5,94.98 285.5,91.68 285.5,-0.52 279.65,-0.52 -1.27,-0.52 -1.27,3.29
  pour Bottom: -1.27,94.98 285.5,94.98 285.5,94.73 285.5,-0.52 273.05,-0.52 -1.27,-0.52 -1.27,8.12
N$1
  Bottom 0.152: U$1.1 15.75,75.8 arc-90 D1.A
N$2
  Bottom 0.152: R1.2 arc-90 93.2,1.61 85.27,1.61 arc-90 84.28,2.6 84.28,11.24 arc90 82.8,12.71 71.65,12.71 arc-90 LED1.C | LED1.C arc90 LED1.C
N$3
  Bottom 0.152: D14.A arc-90 258.75,81.64 258.75,87.37 U$14.1 arc90 257.41,88.71 253,88.71 arc90 U$73.P$1
N$4
  Bottom 0.152: U$13.1 229.61,82.2 arc90 D13.A
N$5
  Bottom 0.152: U$12.1 210.56,82.2 arc90 D12.A
N$6
  Bottom 0.152: U$11.1 191.51,82.2 arc90 D11.A
N$7
  Bottom 0.152: U$10.1 172.46,82.2 arc90 D10.A
N$8
  Bottom 0.152: U$9.1 154.38,86.97 154.38,81.23 arc90 D9.A
N$9
  Bottom 0.152: U$8.1 134.36,82.2 arc90 D8.A
N$10
  Bottom 0.152: U$7.1 115.31,82.2 arc90 D7.A
N$11
  Bottom 0.152: U$6.1 96.26,82.2 arc90 D6.A
N$12
  Bottom 0.152: U$5.1 77.21,82.2 arc90 D5.A
N$13
  Bottom 0.152: U$4.1 58.16,82.2 arc90 D4.A
N$14
  Bottom 0.152: U$3.1 39.11,82.2 arc90 D3.A
N$15
  Bottom 0.152: U$2.1 34.8,75.85 arc90 D2.A
N$16
  Bottom 0.152: U$15.1 5.77,63.15 arc90 D15.A
N$17  (via drill 0.35)
  Top 0.152: v93.07,6.52 93.07,5.02 arc-90 90.53,2.48 85.83,2.48 arc-90 83.57,4.74 83.57,6.08 arc90 81.03,8.62 76.43,8.62 arc-90 75.7,9.35 J1.1
  Bottom 0.152: v93.07,6.52 arc-90 v93.06,6.52 IC3.P1.07
N$18
  Bottom 0.152: U$28.1 262.95,63.15 arc90 D28.A
N$19
  Bottom 0.152: U$27.1 239.14,63.15 arc90 D27.A
N$20
  Bottom 0.152: U$26.1 220.09,63.15 arc90 D26.A
N$21
  Bottom 0.152: U$25.1 201.04,63.15 arc90 D25.A
N$22
  Bottom 0.152: U$24.1 181.99,63.15 arc90 D24.A
N$23
  Bottom 0.152: U$23.1 162.96,63.12 arc90 D23.A
N$24
  Bottom 0.152: U$22.1 143.89,63.15 arc90 D22.A
N$25
  Bottom 0.152: U$21.1 124.84,63.15 arc90 D21.A
N$26
  Bottom 0.152: U$20.1 105.79,63.15 arc90 D20.A
N$27
  Bottom 0.152: U$19.1 86.74,63.15 arc90 D19.A
N$28
  Bottom 0.152: U$18.1 67.69,63.15 arc90 D18.A
N$29
  Bottom 0.152: U$17.1 48.64,63.15 arc90 D17.A
N$30
  Bottom 0.152: U$16.1 29.59,63.15 arc90 D16.A
N$31
  Bottom 0.152: U$29.1 8.16,44.1 arc90 D29.A
N$32  (via drill 0.35)
  Top 0.152: v94.16,6.52 94.16,4.74 arc-90 91.62,2.2 85.8,2.2 arc-90 83.29,4.71 83.29,6.08 arc90 81.03,8.34 75.51,8.34 arc-90 J1.2
  Bottom 0.152: v94.16,6.52 IC3.P1.05 arc-90 IC3.P1.05
N$33
  Bottom 0.152: U$41.1 255.81,44.1 arc90 D41.A
N$34
  Bottom 0.152: U$40.1 224.85,44.1 arc90 D40.A
N$35
  Bottom 0.152: U$39.1 205.8,44.1 arc90 D39.A
N$36
  Bottom 0.152: U$38.1 186.75,44.1 arc90 D38.A
N$37
  Bottom 0.152: U$37.1 167.7,44.1 arc90 D37.A
N$38
  Bottom 0.152: U$36.1 148.65,44.1 arc90 D36.A
N$39
  Bottom 0.152: U$35.1 129.6,44.1 arc90 D35.A
N$40
  Bottom 0.152: U$34.1 110.55,44.1 arc90 D34.A
N$41
  Bottom 0.152: U$33.1 91.5,44.1 arc90 D33.A
N$42
  Bottom 0.152: U$32.1 72.45,44.1 arc90 D32.A
N$43
  Bottom 0.152: U$31.1 53.4,44.1 arc90 D31.A
N$44
  Bottom 0.152: U$30.1 34.35,44.1 arc90 D30.A
N$45
  Bottom 0.152: U$42.1 12.92,25.05 arc90 D42.A
N$46  (via drill 0.35)
  Top 0.152: v95.25,6.52 95.25,4.46 arc-90 92.71,1.92 85.8,1.92 arc-90 83.01,4.71 83.01,6.08 arc90 81.03,8.06 74.52,8.06 arc-90 J1.3
  Bottom 0.152: v95.25,6.52 95.25,7.54 arc-90 IC3.P0.24
N$47
  Bottom 0.152: U$53.1 251.04,25.05 arc90 D53.A
N$48
  Bottom 0.152: U$52.1 215.32,25.05 arc90 D52.A
N$49
  Bottom 0.152: U$51.1 196.28,25.05 arc90 D51.A
N$50
  Bottom 0.152: U$50.1 177.22,25.05 arc90 D50.A
N$51
  Bottom 0.152: U$49.1 158.17,25.05 arc90 D49.A
N$52
  Bottom 0.152: U$48.1 139.12,25.05 arc90 D48.A
N$53
  Bottom 0.152: U$47.1 120.07,25.05 arc90 D47.A
N$54
  Bottom 0.152: U$46.1 101.02,25.05 arc90 D46.A
N$55
  Bottom 0.152: U$45.1 81.98,25.05 arc90 D45.A
N$56
  Bottom 0.152: U$44.1 62.92,25.05 arc90 D44.A
N$57
  Bottom 0.152: U$43.1 43.87,25.05 arc90 D43.A
N$58
  Bottom 0.152: U$54.1 3.39,6 arc90 D54.A
N$59  (via drill 0.35)
  Top 0.152: v96.32,6.52 96.32,4.18 arc-90 93.78,1.64 85.8,1.64 arc-90 82.73,4.71 82.73,6.08 arc90 81.03,7.79 73.53,7.79 arc-90 J1.4
  Bottom 0.152: v96.32,6.52 96.32,7.51 arc-90 IC3.P0.20
N$60
  Bottom 0.152: U$61.1 265.33,6 arc90 D61.A
N$61
  Bottom 0.152: U$60.1 241.52,6 arc90 D60.A
N$62
  Bottom 0.152: U$59.1 217.71,6 arc90 D59.A
N$63
  Bottom 0.152: U$58.1 193.89,6 arc90 D58.A
N$64
  Bottom 0.152: U$57.1 122.46,6 arc90 D57.A
N$65
  Bottom 0.152: U$56.1 51.02,6 arc90 D56.A
N$66
  Bottom 0.152: U$55.1 27.21,6 arc90 D55.A
N$67  (via drill 0.35)
  Top 0.152: v97.46,6.52 97.46,3.9 arc-90 94.92,1.36 85.78,1.36 arc-90 82.45,4.69 82.45,6.06 arc90 81,7.51 72.54,7.51 arc-90 J1.5
  Bottom 0.152: v97.46,6.52 IC3.P0.17 | IC3.P0.17 arc90 IC3.P0.17
N$68  (via drill 0.35)
  Top 0.152: v271.65,82.51 269.6,82.51 arc90 268.83,81.75 268.83,79.34 arc90 v268.86,79.31
  Bottom 0.152: U$74.P$1 arc-90 272.26,86.94 272.26,83.12 arc-90 v271.65,82.51 | v268.86,79.31 D62.A
N$69
  Bottom 0.305: IC1.2 116.12,8.16 arc-90 R15.1 arc90 114.2,7.91 114.2,5.22 arc90 115.11,4.31 C5.1
N$70  (via drill 0.35)
  Top 0.305: v15.01,87.16 19.52,87.16 arc90 v19.94,87.58
  Bottom 0.305: FUSE.2 11.05,90.16 arc-90 11.96,89.24 11.96,88 arc90 12.8,87.16 v15.01,87.16 arc90 15.02,87.17 J3.VBUS1 | v19.94,87.58 19.94,88.71 arc90 J3.VBUS2
N$72
  Bottom 0.152: R11.2 arc90 24.42,91.3 20.07,91.3 arc90 19.18,90.41 19.18,88.78 arc90 J3.B5
N$73
  Bottom 0.152: R12.2 arc-90 26.92,90.89 26.92,89.01 arc-90 25.02,87.11 17.14,87.11 arc-90 16.23,88.03 16.23,88.15 J3.A5
N$74
  Bottom 0.305: U$63.2 112.67,13.29 arc90 112.12,12.74 112.12,10.63 arc-90 111.73,10.25 110.95,10.25 arc-90 R13.2
N$75  (via drill 0.35)
  Top 0.152: v186.8,16.28 arc90 185.12,14.59 arc-90 183.24,12.71 136.8,12.71 arc-90 134.65,14.87 134.65,15.02 arc90 132.54,17.13 114.5,17.13 arc90 112.78,15.41 arc-90 111.86,14.49 110.13,14.49 arc90 v109.09,13.45
  Bottom 0.152: v186.8,16.28 LED2.C | v109.09,13.45 arc-90 v109.1,13.44 R14.1
  Bottom 0.305: v110.03,11.24 110.03,11.34 arc90 R14.1
N$76  (via drill 0.35)
  Top 0.305: v111.99,13.83 arc90 112.52,13.3 119.06,13.3 arc90 v120.45,14.68
  Bottom 0.305: v110.8,11.24 R14.2 arc-90 R14.2 110.8,12.36 arc-90 111.28,12.84 arc90 111.58,13.14 111.58,13.43 arc-90 v111.99,13.83 | v120.45,14.68 120.45,14.35 arc-90 119.39,13.29 U$63.7
N$81  (via drill 0.35)
  Top 0.305: v122.81,3.72 121.67,3.72 arc-90 v119.36,6.03
  Bottom 0.305: U2.3 110.14,8.44 arc-90 110.97,7.61 110.97,7.23 arc-90 110.24,6.49 109.99,6.49 U2.1 arc90 109.11,5.7 C6.1 109.11,4.12 arc-90 D63.1 arc90 108.86,1.31 121.36,1.31 arc90 122.83,2.78 122.83,3.7 arc90 v122.81,3.72 | v119.36,6.03 arc-90 119.74,5.65 Q5.2
RESET  (via drill 0.3, 0.35)
  Top 0.152: v144.27,17.51 145.95,17.51 arc-90 148.51,14.94 v148.51,14.57
  Top 0.305: v81.86,5.14 arc-90 81.28,4.56 43.94,4.56 arc-90 41.55,6.95 41.55,39.28 arc90 39.01,41.82 v33.86,41.82 | v100.38,2.98 100.38,5.91 arc-90 v100.99,6.52
  Bottom 0.152: v144.27,17.51 arc90 144.09,17.69 108.33,17.69 arc90 107.77,17.13 107.77,12.11 arc-90 IC3.P0.18 | PROG1.3 arc90 150.63,6.79 146.36,6.79 arc90 145.44,5.88 arc-90 144.36,4.8 R2.2 arc90 139.57,5.92 139.57,12.03 arc-90 142.11,14.57 v148.51,14.57
  Bottom 0.305: U$62.C U$62.D 25.37,44.36 arc90 27.91,41.82 v33.86,41.82 | v81.86,5.14 arc-90 83.92,3.09 83.92,2.6 arc90 85.27,1.26 98.65,1.26 arc90 v100.38,2.98 | IC3.P0.14 99.66,7.01 arc90 100.15,6.52 v100.99,6.52 101.47,6.52 arc90 101.85,6.9 IC3.P0.16 arc-90 103.91,9.6 IC3.P0.18
ROW1
  Bottom 0.152: D1.C 33.29,75.79 arc-90 33.78,75.3 arc90 34.42,74.66 36.58,74.66 arc90 36.96,75.04 36.96,75.78 arc90 D2.C 36.92,76.95 arc-90 39.46,79.49 41.91,79.49 arc90 42.76,80.34 D3.C arc90 43.9,79.49 61.09,79.49 arc90 61.81,80.21 D4.C arc90 62.95,79.49 80.14,79.49 arc90 80.86,80.21 D5.C arc90 82,79.49 99.19,79.49 arc90 99.91,80.21 D6.C arc90 101.05,79.49 118.24,79.49 arc90 118.96,80.21 D7.C arc90 120.1,79.49 137.29,79.49 arc90 138.01,80.21 D8.C arc90 139.15,79.49 145.95,79.49 arc90 147.68,81.22 147.68,82.49 arc-90 149.2,84.01 152.5,84.01 arc-90 153.97,82.54 153.97,80.94 arc90 155.42,79.49 156.34,79.49 arc90 157.06,80.21 D9.C arc90 158.2,79.49 175.39,79.49 arc90 176.11,80.21 D10.C arc90 177.25,79.49 194.44,79.49 arc90 195.16,80.21 D11.C arc90 196.3,79.49 213.49,79.49 arc90 214.21,80.21 D12.C arc90 215.35,79.49 232.54,79.49 arc90 233.26,80.21 D13.C arc90 234.05,79.85 261.47,79.85 arc90 261.83,80.21 D14.C 278.44,80.63 arc-90 280.98,78.09 280.98,47.71 arc-90 278.36,45.1 268.94,45.1 arc90 267.18,43.35 267.18,21.65 arc-90 264.77,19.24 252.4,19.24 arc90 251.71,18.55 251.71,18.3 arc-90 248.77,15.35 243.53,15.35 arc-90 240.97,17.92 arc90 240.26,18.63 184.81,18.63 arc90 183.21,17.03 183.21,16.88 arc-90 180.21,13.88 179.27,13.88 arc-90 176.68,16.47 arc90 175.74,17.41 145.54,17.41 arc90 145.41,17.28 arc-90 144.75,16.62 143.71,16.62 arc-90 143.49,16.85 arc90 143.21,17.13 108.46,17.13 arc90 108.33,17.01 108.33,6.9 arc-90 105.79,4.36 102.62,4.36 arc-90 101.86,5.11 IC3.P1.00
ROW2
  Bottom 0.152: D15.C arc90 10.56,60.44 32.51,60.44 arc90 33.23,61.16 D16.C arc90 34.38,60.44 51.56,60.44 arc90 52.28,61.16 D17.C arc90 53.43,60.44 70.61,60.44 arc90 71.34,61.16 D18.C arc90 72.48,60.44 89.66,60.44 arc90 90.38,61.16 D19.C arc90 91.53,60.44 108.71,60.44 arc90 109.43,61.16 D20.C arc90 110.58,60.44 127.76,60.44 arc90 128.48,61.16 D21.C arc90 129.63,60.44 146.81,60.44 arc90 147.53,61.16 D22.C arc90 148.68,60.44 165.86,60.44 arc90 166.58,61.16 D23.C arc90 167.73,60.44 184.91,60.44 arc90 185.63,61.16 D24.C arc90 186.78,60.44 203.96,60.44 arc90 204.69,61.16 D25.C arc90 205.83,60.44 223.01,60.44 arc90 223.73,61.16 D26.C arc90 224.88,60.44 242.06,60.44 arc90 242.78,61.16 D27.C arc90 243.93,60.44 265.94,60.44 arc90 266.6,61.1 D28.C 268.27,61.58 arc-90 271.02,58.84 271.02,47.46 arc-90 268.94,45.38 arc90 266.9,43.35 266.9,21.65 arc-90 264.77,19.52 252.4,19.52 arc90 251.44,18.55 arc-90 248.51,15.63 243.69,15.63 arc-90 241.25,18.07 arc90 240.41,18.91 184.68,18.91 arc90 182.91,17.13 arc-90 179.93,14.16 179.45,14.16 arc-90 176.96,16.65 arc90 175.92,17.69 145.39,17.69 arc90 145.11,17.41 arc-90 144.6,16.9 143.99,16.9 arc-90 143.69,17.21 arc90 143.49,17.41 108.33,17.41 arc90 108.05,17.13 108.05,7.18 arc-90 105.51,4.64 103.77,4.64 arc-90 IC3.P0.22
ROW3  (via drill 0.35)
  Top 0.152: v266.18,39.48 266.18,42.18 arc-90 268.72,44.72 272.49,44.72 arc90 v273.48,45.71
  Bottom 0.152: D29.C arc90 12.95,41.39 37.34,41.39 arc90 38,42.05 D30.C arc90 39.14,41.39 56.39,41.39 arc90 57.05,42.05 D31.C arc90 58.19,41.39 75.44,41.39 arc90 76.1,42.05 D32.C arc90 77.24,41.39 94.49,41.39 arc90 95.15,42.05 D33.C arc90 96.29,41.39 113.54,41.39 arc90 114.2,42.05 D34.C arc90 115.34,41.39 132.59,41.39 arc90 133.25,42.05 D35.C arc90 134.39,41.39 151.51,41.39 arc90 152.3,42.18 D36.C arc90 153.44,41.39 170.69,41.39 arc90 171.35,42.05 D37.C arc90 172.49,41.39 189.74,41.39 arc90 190.4,42.05 D38.C arc90 191.54,41.39 208.79,41.39 arc90 209.45,42.05 D39.C arc90 210.59,41.39 227.84,41.39 arc90 228.5,42.05 D40.C 254.89,42.53 arc-90 255.52,41.9 arc90 256.03,41.39 258.7,41.39 arc90 259.46,42.15 D41.C 264.03,42.53 arc-90 266.62,39.94 266.62,39.04 | 266.62,39.04 266.62,21.68 arc-90 264.74,19.8 252.37,19.8 arc90 251.16,18.58 arc-90 248.49,15.91 243.87,15.91 arc-90 241.53,18.25 arc90 240.59,19.19 184.66,19.19 arc90 182.63,17.16 arc-90 179.91,14.44 179.6,14.44 arc-90 177.24,16.8 arc90 176.07,17.97 108.33,17.97 arc90 107.49,17.13 107.49,12.93 arc-90 IC3.P0.19 | D62.C arc-90 273.3,80.33 278.16,80.33 arc-90 280.69,77.79 280.69,48.25 arc-90 278.16,45.71 v273.48,45.71 | v266.18,39.48 arc-90 266.62,39.04
ROW4
  Bottom 0.152: D42.C arc90 17.4,22.64 47.04,22.64 arc90 47.52,23.13 D43.C arc90 48.66,22.34 65.91,22.34 arc90 66.57,23 D44.C arc90 67.72,22.34 84.84,22.34 arc90 85.62,23.13 D45.C arc90 86.77,22.34 104.01,22.34 arc90 104.67,23 D46.C arc90 105.82,22.34 122.94,22.34 arc90 123.72,23.13 D47.C arc90 124.87,22.34 142.11,22.34 arc90 142.77,23 D48.C arc90 143.91,22.34 161.16,22.34 arc90 161.82,23 D49.C arc90 162.97,22.34 180.21,22.34 arc90 180.87,23 D50.C arc90 182.02,22.34 199.26,22.34 arc90 199.92,23 D51.C arc90 201.06,22.34 218.31,22.34 arc90 218.97,23 D52.C arc90 219.76,22.7 254.36,22.7 arc90 254.69,23.03 D53.C 264.44,23.48 arc-90 266.29,21.63 arc-90 264.74,20.08 252.35,20.08 arc90 250.88,18.61 arc-90 248.46,16.19 244.07,16.19 arc-90 241.81,18.45 arc90 240.79,19.47 189.51,19.47 arc-90 189.08,19.9 arc90 188.87,20.1 176.48,20.1 arc90 175.92,19.55 arc-90 174.62,18.25 108.33,18.25 arc90 107.21,17.13 107.21,13.75 arc-90 IC3.P0.21
ROW5  (via drill 0.35)
  Top 0.152: v265.08,20.77 265.08,19.62 arc90 267.88,16.83 278.54,16.83 arc-90 281.08,14.29 281.08,6.95 arc-90 278.54,4.41 v270.08,4.41
  Bottom 0.152: D54.C arc90 8.18,3.29 30.23,3.29 arc90 30.85,3.92 D55.C arc90 32,3.29 53.98,3.29 arc90 54.67,3.98 D56.C 81.86,4.43 arc-90 83.03,3.26 83.03,2.83 arc90 85.27,0.6 123.87,0.6 arc90 126.1,2.83 | v265.08,20.77 arc90 264.81,21.04 252.48,21.04 arc90 250.6,19.16 arc-90 247.9,16.47 244.27,16.47 arc-90 242.11,18.63 arc90 241,19.75 189.69,19.75 arc-90 189.33,20.1 arc90 189.05,20.38 176.4,20.38 arc90 175.64,19.62 arc-90 174.55,18.53 108.33,18.53 arc90 106.93,17.13 106.93,14.57 arc-90 IC3.P0.23 | v270.08,4.41 269,4.41 arc-90 D61.C 268.98,4.04 arc-90 268.22,3.29 246.31,3.29 arc-90 D60.C 245.17,4.11 arc-90 244.35,3.29 222.5,3.29 arc-90 D59.C 221.35,3.92 arc-90 220.73,3.29 198.68,3.29 arc-90 D58.C 197.54,2.83 arc-90 196.65,1.94 184.53,1.94 arc-90 183.52,2.96 arc90 181.79,4.69 178,4.69 arc90 176.12,2.81 arc-90 175.26,1.94 126.99,1.94 arc-90 126.1,2.83 | D57.C 126.1,2.83
SCK  (via drill 0.35)
  Top 0.152: v107.47,4.36 arc90 108.94,2.88 153.06,2.88 arc90 154.58,4.41 154.58,5.11 arc-90 PROG1.4
  Bottom 0.152: v107.47,4.36 arc-90 107.19,4.08 98.83,4.08 arc-90 IC3.SWDCLK
SWD  (via drill 0.35)
  Top 0.152: v107.04,3.61 arc90 108.04,2.6 154.69,2.6 arc90 157.26,5.17 PROG1.5
  Bottom 0.152: v107.04,3.61 arc90 106.85,3.8 98.01,3.8 arc-90 IC3.SWDIO
V_BATT  (via drill 0.35)
  Top 0.305: J4.1 156.29,74.99 arc-90 158.12,73.16 158.12,56.65 arc90 160,54.78 161.95,54.78 arc-90 162.94,53.78 162.94,37.99 arc90 164.97,35.95 171.6,35.95 arc-90 173.46,34.1 173.46,18.48 arc-90 171.55,16.57 v166.8,16.57 | v120.68,8.01 120.68,8.14 arc90 118.14,10.68 v116.69,10.68 | v116.43,3.72 116.43,5.47 arc-90 118.97,8.01 v120.68,8.01 | v123.3,15.99 arc-90 123.8,15.49 123.8,11.14 arc-90 123.24,10.58 arc90 122.67,10.01 122.67,8.19 arc90 123.76,7.1 arc-90 124.52,6.34 124.52,5.3 arc-90 123.97,4.74 121.49,4.74 arc-90 120.76,5.46 120.76,7.93 arc90 v120.68,8.01
  Bottom 0.305: 122.52,16.78 119.87,16.78 arc90 U$63.5 arc90 U$63.5 | 122.52,16.78 142.93,16.78 arc-90 143.03,16.68 arc90 143.46,16.24 145.21,16.24 arc90 145.67,16.7 arc-90 146.03,17.06 166.32,17.06 arc-90 v166.8,16.57 | R15.2 115.28,10.73 arc90 115.34,10.68 v116.69,10.68 | Q5.3 120.69,8 arc90 v120.68,8.01 | R19.1 115.87,3.16 arc-90 v116.43,3.72 | J4.1 152.53,78.6 arc90 CN2.2 | 122.52,16.78 arc-90 v123.3,15.99
V_USB  (via drill 0.35)
  Top 0.305: v87.73,20.45 92.26,20.45 arc-90 94.11,18.61 94.11,11.04 arc90 96.65,8.5 v104.29,8.5 arc-90 105.08,7.71 v105.08,3.29 | v107.14,9.59 107.14,14.14 arc-90 108.61,15.61 111.05,15.61 arc90 v111.94,16.5 | v123.52,6.24 122.25,6.24 arc90 v121.72,5.7 121.72,9.33 arc90 v119.99,11.06 120.89,11.06 arc90 123.25,13.42 123.25,13.97 arc90 120.71,16.51 v117.21,16.51 | v1.83,89.57 1.84,89.56 1.84,64.26 arc90 4.37,61.73 v4.83,61.73
  Bottom 0.152: PROG1.6 182.78,5.25 arc90 185.32,7.79 185.32,12.64 arc-90 186.87,14.19 LED2.A arc-90 LED2.A
  Bottom 0.305: v87.73,20.45 78.07,20.45 arc90 76.63,19.01 arc-90 74.62,17.01 18.01,17.01 arc-90 15.47,19.55 15.47,20.51 arc90 13.56,22.42 12.29,22.42 arc-90 11.35,23.36 11.35,38.54 arc90 9.55,40.35 8.87,40.35 arc-90 6.2,43.02 6.2,55.56 | 6.2,55.56 6.2,60.36 arc90 v4.83,61.73 | v107.14,9.59 arc-90 106.05,8.5 arc90 106.05,8.5 IC3.VBUS v104.29,8.5 arc90 v104.29,8.5 | D63.2 105.26,3.11 arc90 v105.08,3.29 | PROG1.6 159.8,5.14 arc-90 157.26,2.6 128.83,2.6 arc-90 127.46,3.98 127.46,4.69 | 127.46,4.69 arc90 125.91,6.24 v123.52,6.24 | U$63.8 arc-90 U$63.8 119.03,12.02 arc-90 v119.99,11.06 | R17.2 arc-90 118.67,4.96 118.67,3.75 arc90 119.41,3.01 121.18,3.01 arc90 121.69,3.52 121.69,4.35 | 121.69,4.35 arc90 Q5.1 | v121.72,5.7 121.72,4.38 arc-90 121.69,4.35 | C4.1 arc-90 111.34,16.5 v111.94,16.5 112.76,16.5 arc-90 U$63.4 arc-90 114.1,16.51 v117.21,16.51 | J2.1 7.77,57.14 arc90 6.2,55.56 | D67.A 127.74,4.41 arc-90 127.46,4.69 | FUSE.1 2.41,90.16 arc90 v1.83,89.57
VDD_NRF  (via drill 0.35)
  Top 0.305: v105.26,18.28 arc-90 106.53,17.01 106.53,8.88 arc90 108.05,7.35 v111.66,7.35 arc90 113.39,9.08 113.39,10 arc-90 115.93,12.54 121.26,12.54 arc90 v122.43,13.7
  Bottom 0.305: v122.43,13.7 arc-90 123.22,14.49 127.99,14.49 arc-90 129.06,13.42 arc90 130.33,12.15 136.65,12.15 arc-90 138.48,10.33 138.48,6.53 arc-90 R2.1 137.6,6.5 arc90 136.73,5.63 136.73,5.09 | U2.5 arc-90 111.66,7.19 v111.66,7.35 | 136.73,5.09 136.73,4.41 arc90 137.57,3.57 145.42,3.57 arc90 PROG1.1 | D66.A 136.04,4.41 arc90 136.73,5.09 | IC3.VDD_NRF arc-90 IC3.VDD_NRF v105.26,18.28

## Text on the board
bNames: + | + | 5V | D- | D+ | GND | SPARES | VREF | GND | RST | SCK | SWD | 5V
tStop: POLARITY WORKS BT60